# Altium schematic sheet ZX-XH2.54-4PZZ1_ZX-XH2.54-4PZZ.schdoc
size 124 x 99 mm
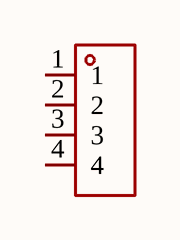
[diagram p0: ZX-XH2.54-4PZZ1_ZX-XH2.54-4PZZ.schdoc]

## Parts
CN?  ZX-XH2.54-4PZZ  [CONN-TH_4P-P2.50_4PIN]  (value not drawn)

## Nets

Not connected (* = marked no-connect by the designer): CN? 1 2 3 4

## Library data of the parts
CN? = ZX-XH2.54-4PZZ: Manufacturer: Megastar(兆星); Add into BOM: yes; Pins Structure: 1x4P; Pitch: 2.54mm; Reference Series: XH; Number of PINs Per Row: 4; Current Rating (Max): 3A; Symbol: ZX-XH2.54-4PZZ; Device: ZX-XH2.54-4PZZ; LCSC Part Name: ZX-XH2.54-4PZZ; Supplier Part: C7429634; Manufacturer Part: ZX-XH2.54-4PZZ; Supplier Footprint: 插件,P=2.54mm; JLCPCB Part Class: Extended Part; Datasheet: https://atta.szlcsc.com/upload/public/pdf/source/20230619/B529A2163E0159A644AB3383D208FB03.pdf; Supplier: LCSC; Convert to PCB: yes; Mounting Style: 直插; Number of Pins: 4P; Number of Rows: 1; Row Spacing: -; Contact Material: 黄铜; Contact Plating: 锡; Operating Temperature Range: -25℃~+85℃